# EAGLE design LEVER-board-production-0 (SENT to OSHPark) (EAGLE 6.6.0)
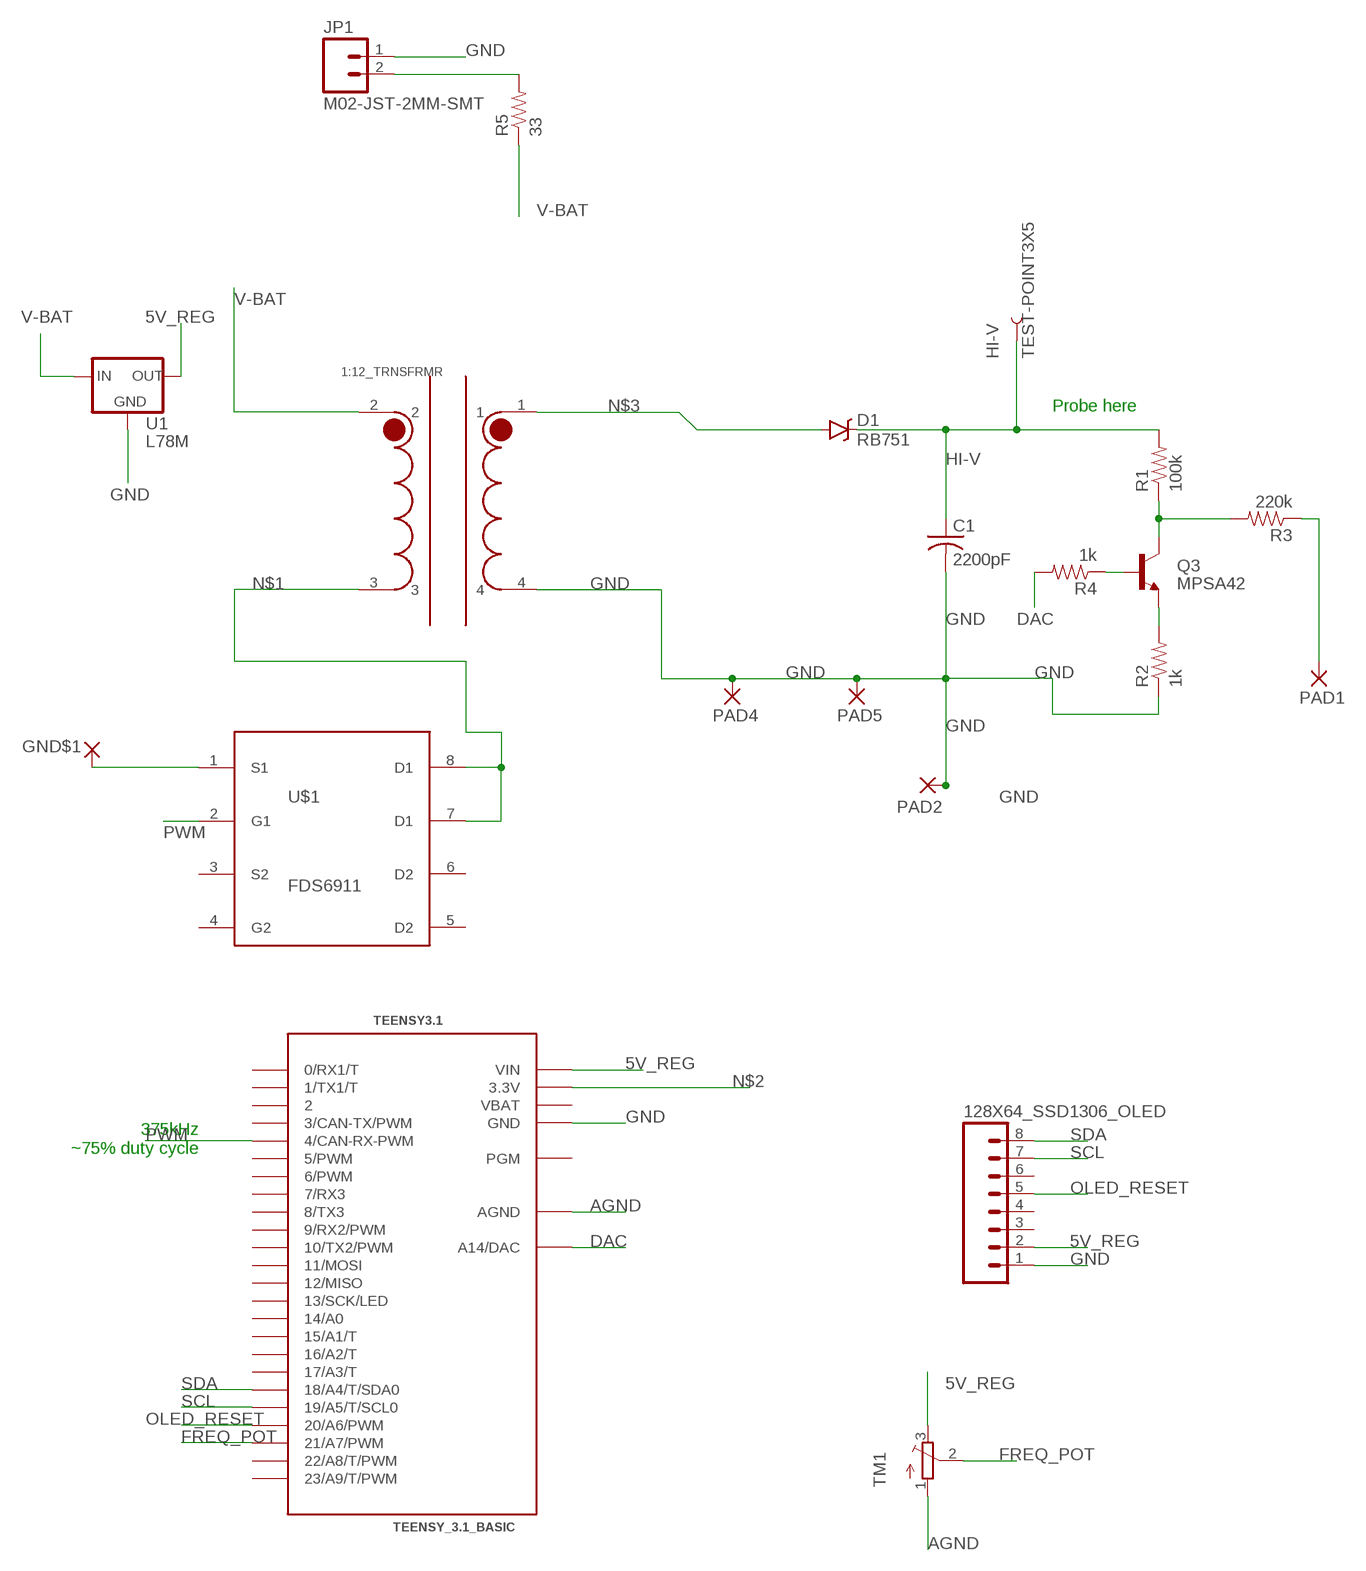
[diagram p0: schematic, sheet 1]

## Parts
1:12_TRNSFRMR  PA0367  [PA0367]
128X64_SSD1306_OLED  M08LOCK  [1X08_LOCK]
C1  2200pF  C-USC1812  [C1812]
D1  RB751  QH03BZ600  [TO263]
GND$1  WIREPADSMD5-2,5  [5-2,5]
HI-V  TEST-POINT3X5  [PAD.03X.05]
JP1  M02-JST-2MM-SMT  [JST-2-SMD]
PAD1  WIREPADSMD5-2,5  [5-2,5]
PAD2  WIREPADSMD5-2,5  [5-2,5]
PAD4  WIREPADSMD5-2,5  [5-2,5]
PAD5  WIREPADSMD5-2,5  [5-2,5]
Q3  MPSA42  TRANSISTOR_NPNP2N2222A  [TO-92]
R1  100k  RESISTOR2010  [R2010]
R2  1k  RESISTOR1206  [1206]
R3  220k  RESISTOR2010  [R2010]
R4  1k  RESISTOR1206  [1206]
R5  33  RESISTOR1206  [1206]
TEENSY3.1  TEENSY_3.1_BASIC  [TEENSY_3.1_BASIC]
TM1  TRIMPOT3386  [TRIM-3386]
U1  L78M  [DPAK]
U$1  FDS6911  [SO8]

## Nets
5V_REG: 128X64_SSD1306_OLED.2 TEENSY3.1.VIN TM1.3(E) U1.3(OUT)
AGND: TEENSY3.1.AGND TM1.1(A)
DAC: R4.2 TEENSY3.1.A14(A14/DAC)
FREQ_POT: TEENSY3.1.21/A7(21/A7/PWM) TM1.2(S)
GND: 1:12_TRNSFRMR.4 128X64_SSD1306_OLED.1 C1.2 GND$1.1(P) JP1.1 PAD2.1(P) PAD4.1(P) PAD5.1(P) R2.1 TEENSY3.1.GND TEENSY3.1.GND1(GND) U1.4(GND) U$1.1(S1)
HI-V: C1.1 D1.1(C) HI-V.P$1 R1.2
N$1: 1:12_TRNSFRMR.3 U$1.7(D1) U$1.8(D1)
N$2: TEENSY3.1.3.3V TEENSY3.1.3.3V1(3.3V)
N$3: 1:12_TRNSFRMR.1 D1.2(A)
N$4: JP1.2 R5.2
N$13: Q3.1(C) R1.1 R3.2
N$14: Q3.3(E) R2.2
N$15: Q3.2(B) R4.1
OLED_RESET: 128X64_SSD1306_OLED.5 TEENSY3.1.20/A6(20/A6/PWM)
PAD: PAD1.1(P) R3.1
PWM: TEENSY3.1.4(4/CAN-RX-PWM) U$1.2(G1)
SCL: 128X64_SSD1306_OLED.7 TEENSY3.1.19/A5(19/A5/T/SCL0)
SDA: 128X64_SSD1306_OLED.8 TEENSY3.1.18/A4(18/A4/T/SDA0)
V-BAT: 1:12_TRNSFRMR.2 R5.1 U1.1(IN)
Unconnected: 128X64_SSD1306_OLED.3 128X64_SSD1306_OLED.4 128X64_SSD1306_OLED.6 TEENSY3.1.0(0/RX1/T) TEENSY3.1.1(1/TX1/T) TEENSY3.1.2 TEENSY3.1.3(3/CAN-TX/PWM) TEENSY3.1.5(5/PWM) TEENSY3.1.6(6/PWM) TEENSY3.1.7(7/RX3) TEENSY3.1.8(8/TX3) TEENSY3.1.9(9/RX2/PWM) TEENSY3.1.10(10/TX2/PWM) TEENSY3.1.11(11/MOSI) TEENSY3.1.12(12/MISO) TEENSY3.1.13(13/SCK/LED) TEENSY3.1.14/A0 TEENSY3.1.15/A1(15/A1/T) TEENSY3.1.16/A2(16/A2/T) TEENSY3.1.17/A3(17/A3/T) TEENSY3.1.22/A8(22/A8/T/PWM) TEENSY3.1.23/A9(23/A9/T/PWM) TEENSY3.1.PGM U$1.3(S2) U$1.4(G2) U$1.5(D2) U$1.6(D2)

## Notes on the sheet
- Probe here
- 375kHz
  ~75% duty cycle

## Power pins joined to a net without a drawn wire
VBAT: TEENSY3.1.VBAT

## Library data of the parts
1:12_TRNSFRMR = AKA_test:PA0367: SMT Flyback Transformer For PhotoFlash Capacitor Charger For Use with Linear Technology’s LT3420 by Pulse Electronics 1:12 ratio Low side: pins 2 and 3 High side: pins 1 and 4 Pins 2 and 4 are the dotted poles in transformer schematic Min 18 uH inductance at Irated Irated: 1.5A DC Leakage Inductance (2-3 with 1-4 shorted): 0.75 uH MAX Primary DCR: 180 milliohm MAX Secondary DCR 18 ohm MAX Primary Secondary isolation: 500Vrms
128X64_SSD1306_OLED = SparkFun-Connectors:M08: Header 8 Standard 8-pin 0.1" header. Use with straight break away headers (SKU : PRT-00116), right angle break away headers (PRT-00553), swiss pins (PRT-00743), machine pins (PRT-00117), and female headers (PRT-00115).
C1 = adafruit:C-US: CAPACITOR, American symbol
D1 = AKA_test:QH03BZ600: QH03TZ600, QH03BZ600 Qspeed™ Family 600 V, 3 A H-Series PFC Diode Peak repetitive reverse voltage: 600V Reverse Recovery Time: 9.8ns Forward Voltage 2.52V Junction capacitance 11pF Average Forward Current: 3A Datasheet <http://www.mouser.com/ds/2/328/qh03tz600_qh03bz600-257619.pdf>
GND$1 PAD1 PAD2 PAD4 PAD5 = wirepad:WIREPAD: Wire PAD connect wire on PCB
HI-V = SparkFun-Passives:TEST-POINT: Bare copper test points for troubleshooting or ICT
JP1 = SparkFun-Connectors:M02: Standard 2-pin 0.1" header. Use with - straight break away headers ( PRT-00116) - right angle break away headers (PRT-00553) - swiss pins (PRT-00743) - machine pins (PRT-00117) - female headers (PRT-00115) Molex polarized connector foot print use with: PRT-08233 with associated crimp pins and housings. 2.54_SCREWTERM for use with PRT-10571. 3.5mm Screw Terminal footprints for PRT-08084 5mm Screw Terminal footprints for use with PRT-08432; PROD_ID: CONN-08352
Q3 = SparkFun-DiscreteSemi:TRANSISTOR_NPN: Generic NPN BJT MMBT2222A - TRANS-08049 (SOT-23, 1A 40V) MPSA42 - TRANS-09116 (SOT-23, 500mA 300V) MMBT5088LT1G - TRANS-11160 (SOT-23, 50 mA 30V) BC547 - COM-08928 <http://www.sparkfun.com/products/8928> (TO-92 45V 100mA) (1.Collector 2.Base 3.Emitter) 2N3904 - COM-00521 <http://www.sparkfun.com/products/521> (TO-92 40V 200mA) (1.Emitter 2.Base 3.Collector) P2N2222A - COM-12852 <http://www.sparkfun.com/products/12852> (TO-92 40V 600mA) (1.Collector 2.Base 3.Emitter); PROD_ID: TRANS-09536
R1-R5 = SparkFun-Passives:RESISTOR: Resistor Basic schematic elements and footprints for 0603, 1206, and PTH resistors.
TEENSY3.1 = Teensy_3_Series_Board_v1.0:TEENSY_3.1_BASIC: Footprint for Teensy 3.1 board using all pin connections on the outer perimeter
TM1 = adafruit:TRIMPOT: SMT trimmer potentiometer part number TC33X http://www.ladyada.net/library/eagle
U1 = AKA_test:L78M
U$1 = AKA_test:FDS6911: FDS6911 Dual N-Channel Logic Level PowerTrench® MOSFET 20V, 7.5A, 13mΩ

## Board
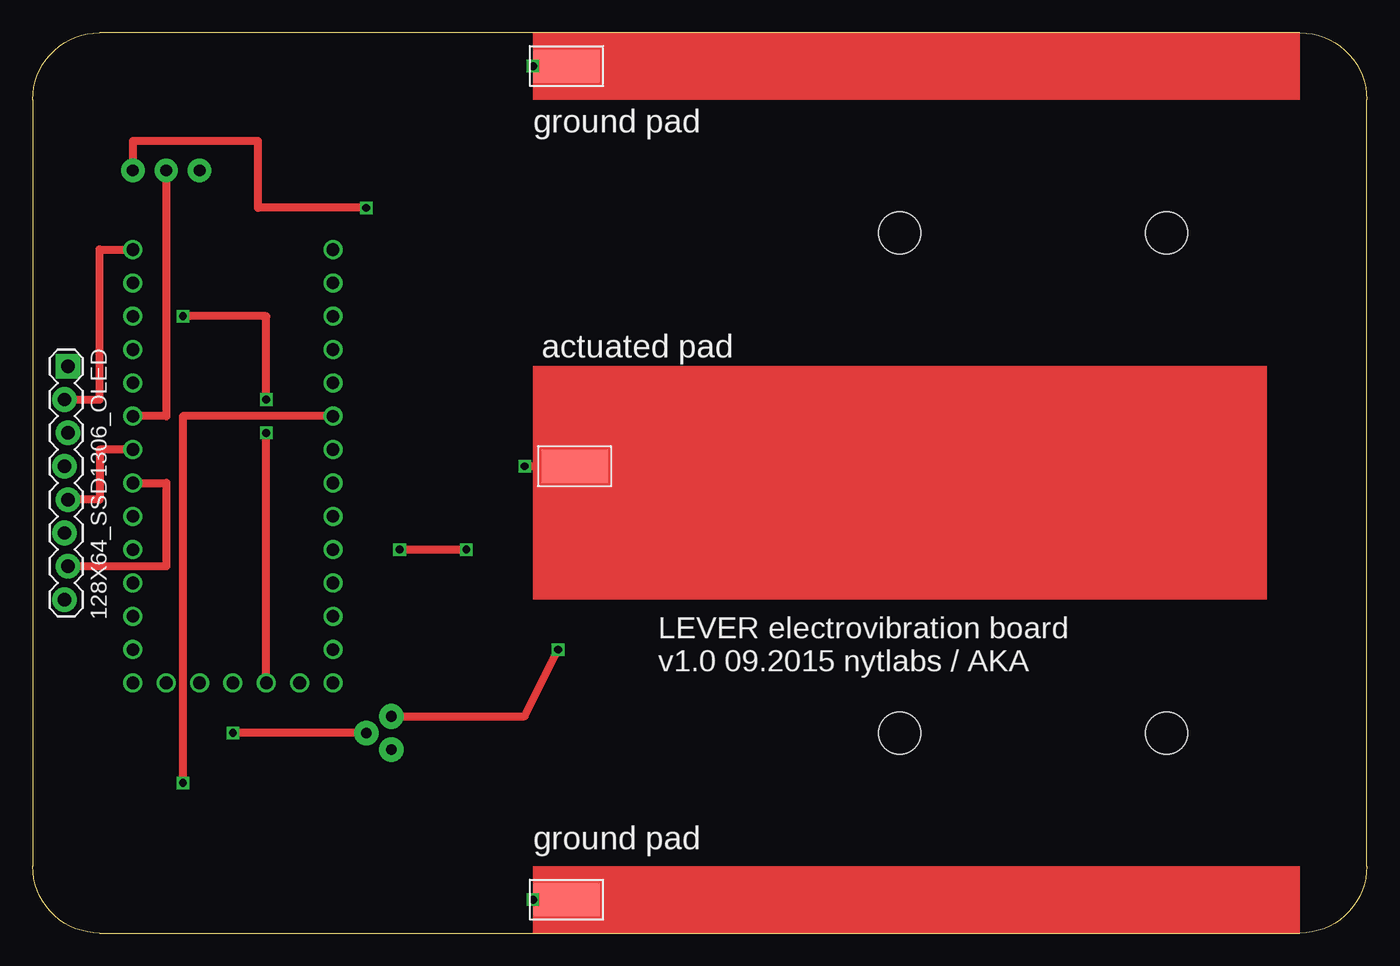
[diagram p1: board, top side]
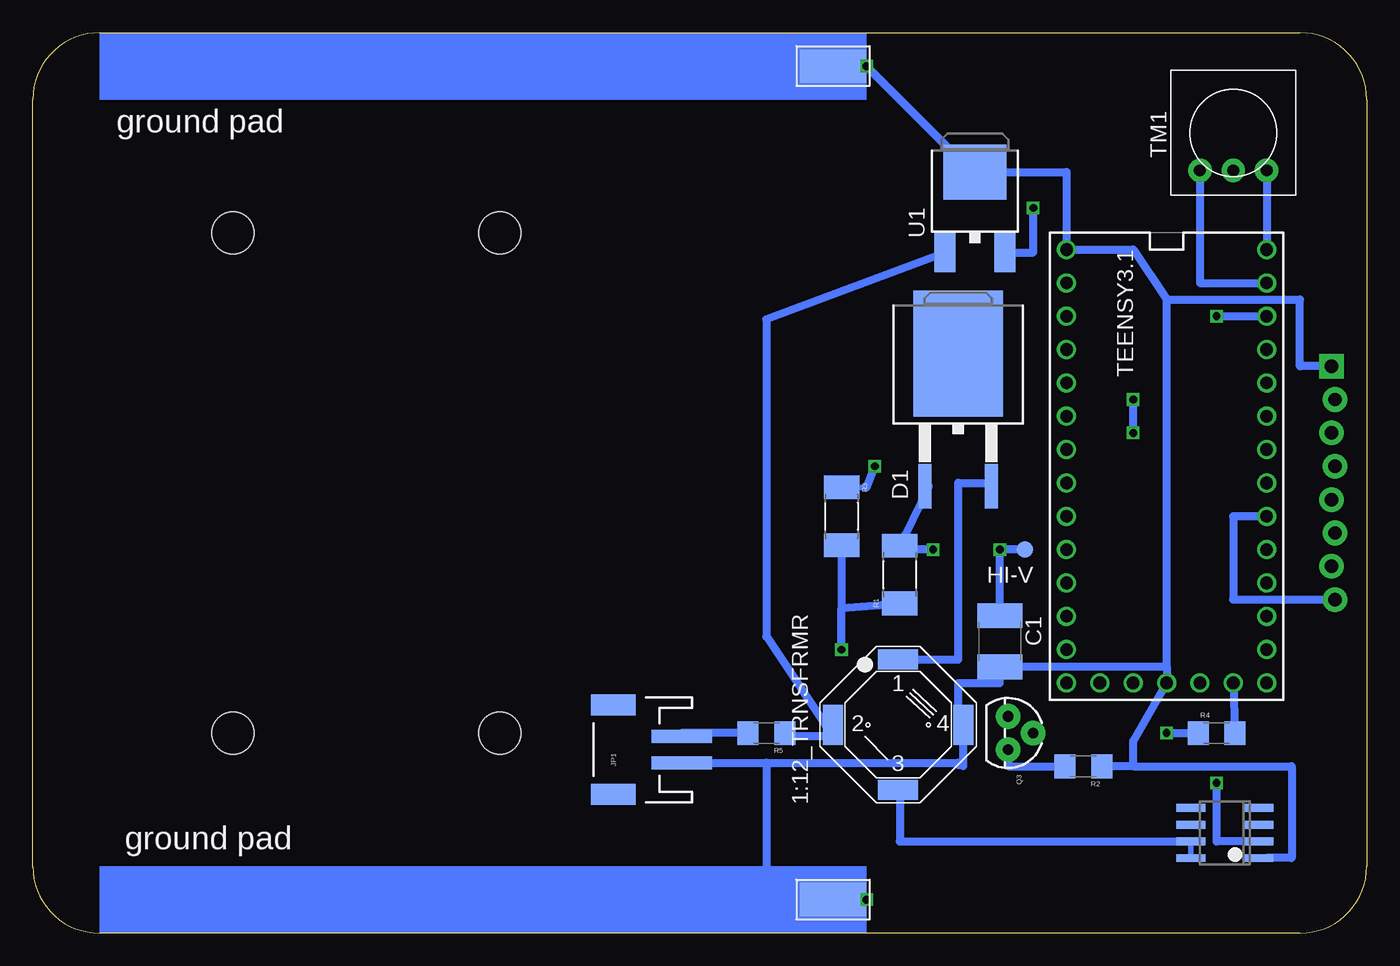
[diagram p2: board, bottom side, seen from below]

Size 101.6 x 68.58 mm. Coordinates in mm from the lower left corner, seen from the top.
Outline: 5.08,0 96.52,0 arc90 101.6,5.08 101.6,63.5 arc90 96.52,68.58 5.08,68.58 arc90 0,63.5 0,5.08 arc90 5.08,0
Copper layers (1*16): Top 0.0356mm / dielectric 1.5011mm / Bottom 0.0356mm
Design rules "LaenPCBOrder": minimum track width 6mil, minimum drill 13mil, track to track 6mil, track to pad 6mil, pad to pad 6mil, via to via 6mil, smd to smd 6mil, copper to edge 15mil, drill to drill 6mil, minimum pad ring 7mil, minimum via ring 7mil, stop-mask expansion 3mil, vias tented up to drill 0mil, thermal gap 10mil
Holes 3.2 mm at 86.36,15.24 86.36,53.34 66.04,15.24 66.04,53.34

### Footprints (pad centres in the part's own frame; a part is rotated, then mirrored left to right if it is on the bottom)
PA0367 = smd 3.048 x 1.524: 1 4.953,4.953; 3 4.953,-4.953 | smd 1.524 x 3.048: 2 0,0; 4 9.906,0
1X08_LOCK = drill 1.016 pad 1.88 square: 1 0,0.127 | drill 1.016 pad 1.88: 2 2.54,-0.127; 3 5.08,0.127; 4 7.62,-0.127; 5 10.16,0.127; 6 12.7,-0.127; 7 15.24,0.127; 8 17.78,-0.127
C1812 = smd 1.9 x 3.4: 1 -1.95,0; 2 1.95,0
TO263 = smd 1 x 3.4: 1 -2.54,-6.6; 2 2.54,-6.6 | smd 6.8 x 9.6: 3 0,3.5
5-2,5 = smd 2.54 x 5.08: 1 0,0
PAD.03X.05 = smd 1.27 x 1.27: P$1 0,0
JST-2-SMD = smd 1 x 4.6: 1 -1,-3.7; 2 1,-3.7 | smd 1.6 x 3.4: NC1 -3.4,1.5; NC2 3.4,1.5
TO-92 = drill 0.813 pad 1.88: 1 -1.27,0; 2 0,1.905; 3 1.27,0
R2010 = smd 1.8 x 2.7: 1 -2.2,0; 2 2.2,0
1206 = smd 1.6 x 1.8: 1 -1.4,0; 2 1.4,0
TEENSY_3.1_BASIC = drill 0.965: 0 -7.62,13.97; 1 -7.62,11.43; 2 -7.62,8.89; 3 -7.62,6.35; 3.3V 7.62,11.43; 3.3V1 -2.54,-16.51; 4 -7.62,3.81; 5 -7.62,1.27; 6 -7.62,-1.27; 7 -7.62,-3.81; 8 -7.62,-6.35; 9 -7.62,-8.89; 10 -7.62,-11.43; 11 -7.62,-13.97; 12 -7.62,-16.51; 13 7.62,-16.51; 14/A0 7.62,-13.97; 15/A1 7.62,-11.43; 16/A2 7.62,-8.89; 17/A3 7.62,-6.35; 18/A4 7.62,-3.81; 19/A5 7.62,-1.27; 20/A6 7.62,1.27; 21/A7 7.62,3.81; 22/A8 7.62,6.35; 23/A9 7.62,8.89; A14 5.08,-16.51; AGND 7.62,13.97; GND -7.62,16.51; GND1 0,-16.51; PGM 2.54,-16.51; VBAT -5.08,-16.51; VIN 7.62,16.51
TRIM-3386 = drill 0.9 pad 1.778: 1 -2.54,-2.857; 2 0,-2.857; 3 2.54,-2.857
DPAK = smd 1.6 x 3: 1 -2.28,-4.04; 3 2.28,-4.04 | smd 4.826 x 4.191: 4 0,2.096
SO8 = smd 0.6 x 2.2: 1 -1.905,-2.6; 2 -0.635,-2.6; 3 0.635,-2.6; 4 1.905,-2.6; 5 1.905,2.6; 6 0.635,2.6; 7 -0.635,2.6; 8 -1.905,2.6

### Placement (x,y rotation side)
1:12_TRNSFRMR  40.64,15.88 0 bottom
128X64_SSD1306_OLED  2.54,43.18 270 top
C1  27.94,22.23 270 bottom
D1  31.11,40.64 0 bottom
GND$1  40.64,66.04 90 top
HI-V  26.04,29.21 0 bottom
JP1  55.88,13.97 90 bottom
PAD1  41.27,35.56 270 top
PAD2  40.64,2.54 90 top
PAD4  40.64,66.04 270 bottom
PAD5  40.64,2.54 270 bottom
Q3  27.3,15.24 270 bottom
R1  35.56,27.3 90 bottom
R2  21.59,12.7 180 bottom
R3  40.01,31.75 270 bottom
R4  11.43,15.24 0 bottom
R5  45.72,15.24 180 bottom
TEENSY3.1  15.24,35.56 0 bottom
TM1  10.16,60.96 0 bottom
U1  29.84,55.88 0 bottom
U$1  10.79,7.62 90 bottom

### Tracks (layer width: path | path; a pad name or v marks a point on that pad's centre or on a via)
5V_REG  (via drill 0.6)
  Top 0.254: 7.62,58.42 TM1.3
  Top 0.61: 128X64_SSD1306_OLED.2 5.08,40.64 5.08,52.07 TEENSY3.1.VIN | v25.4,55.24 17.14,55.24 17.14,60.33 7.62,60.33 TM1.3
  Bottom 0.61: TM1.3 TEENSY3.1.VIN | U1.3 25.4,51.84 v25.4,55.24
AGND
  Bottom 0.61: TM1.1 12.7,49.53 TEENSY3.1.AGND
DAC
  Bottom 0.61: TEENSY3.1.A14 R4.2
FREQ_POT
  Top 0.61: TM1.2 10.16,39.37 TEENSY3.1.21/A7
  Bottom 0.254: 10.16,58.42 TM1.2
GND  (via drill 0.6)
  Top 0.406: v38.1,66.04 PAD4.1 | v38.1,2.54 PAD5.1
  Bottom 0.254: 2.54,43.18 128X64_SSD1306_OLED.1
  Bottom 0.406: 30.48,58.42 U1.4 | PAD4.1 v38.1,66.04 | 45.72,2.54 PAD5.1 v38.1,2.54 | 31.11,12.97 31.11,12.7 30.73,12.7 | R2.1 20.32,12.7 | U$1.1 7.62,5.71 | 1:12_TRNSFRMR.4 31.11,15.88
  Bottom 0.61: v38.1,66.04 30.48,58.42 | JP1.1 45.72,12.97 | 45.72,12.97 45.72,2.54 | 45.72,12.97 31.11,12.97 | 30.73,12.7 1:12_TRNSFRMR.4 | 17.78,12.7 R2.1 | 31.11,15.88 31.11,19.05 27.94,19.05 C1.2 27.94,20.32 | 27.94,20.91 27.94,20.32 | 27.94,20.32 15.24,20.32 | 128X64_SSD1306_OLED.1 5.08,43.18 5.08,48.26 15.24,48.26 | 15.24,20.32 15.24,48.26 | U1.4 22.86,57.98 TEENSY3.1.GND 17.78,52.07 15.24,48.26 | 17.78,12.7 17.78,14.61 TEENSY3.1.GND1 15.24,20.32 | 17.78,12.7 5.71,12.7 5.71,5.71 7.62,5.71
HI-V  (via drill 0.6)
  Top 0.61: v27.94,29.21 v33.02,29.21
  Bottom 0.406: D1.1 33.36,34.04 | R1.2 35.18,30.29 35.18,29.21
  Bottom 0.61: 33.36,34.04 35.18,30.29 | C1.1 v27.94,29.21 HI-V.P$1 | v33.02,29.21 35.18,29.21
N$1
  Bottom 0.406: 1:12_TRNSFRMR.3 35.56,10.92 | U$1.8 U$1.7
  Bottom 0.61: 35.56,10.92 35.56,6.99 U$1.7
N$2  (via drill 0.6)
  Top 0.61: TEENSY3.1.3.3V1 v17.78,38.1 | v17.78,40.64 17.78,46.99 v11.43,46.99
  Bottom 0.61: v17.78,38.1 v17.78,40.64 | v11.43,46.99 TEENSY3.1.3.3V
N$3
  Bottom 0.406: 28.57,34.29 D1.2
  Bottom 0.61: 1:12_TRNSFRMR.1 31.11,20.83 31.11,34.29 28.57,34.29
N$4
  Bottom 0.61: R5.2 52.18,15.24 JP1.2
N$13  (via drill 0.6)
  Top 0.61: Q3.1 37.47,16.51 v40.01,21.59
  Bottom 0.61: R3.2 40.01,24.77 | 40.01,24.77 R1.1 | v40.01,21.59 40.01,24.77
N$14
  Bottom 0.61: Q3.3 27.3,12.7 R2.2
N$15  (via drill 0.6)
  Top 0.61: Q3.2 v15.24,15.24
  Bottom 0.406: 12.7,15.24 R4.1
  Bottom 0.61: v15.24,15.24 R4.1
OLED_RESET
  Top 0.61: TEENSY3.1.20/A6 5.08,36.83 5.08,33.02 128X64_SSD1306_OLED.5
PAD  (via drill 0.6)
  Top 0.61: v37.47,35.56 PAD1.1
  Bottom 0.406: R3.1 38.1,33.95
  Bottom 0.61: 38.1,33.95 v37.47,35.56
PWM  (via drill 0.6)
  Top 0.61: TEENSY3.1.4 11.43,39.37 v11.43,11.43
  Bottom 0.61: U$1.2 11.43,6.99 v11.43,11.43
SCL
  Top 0.254: 2.54,27.94 128X64_SSD1306_OLED.7
  Top 0.61: TEENSY3.1.19/A5 10.16,34.29 10.16,27.94 128X64_SSD1306_OLED.7
SDA
  Top 0.254: 2.54,25.4 128X64_SSD1306_OLED.8
  Bottom 0.61: TEENSY3.1.18/A4 10.16,31.75 10.16,25.4 128X64_SSD1306_OLED.8
V-BAT
  Bottom 0.406: 40.64,14.97 1:12_TRNSFRMR.2
  Bottom 0.61: U1.1 45.72,46.76 45.72,22.59 40.64,14.97 44.32,14.97 R5.1
(copper drawn outside any net)
  shapes: Bottom area x2, Top area x3

### Text on the board
tNames: ground pad | actuated pad | LEVER electrovibration board / v1.0 09.2015 nytlabs / AKA | ground pad
bNames: ground pad | HI-V | ground pad